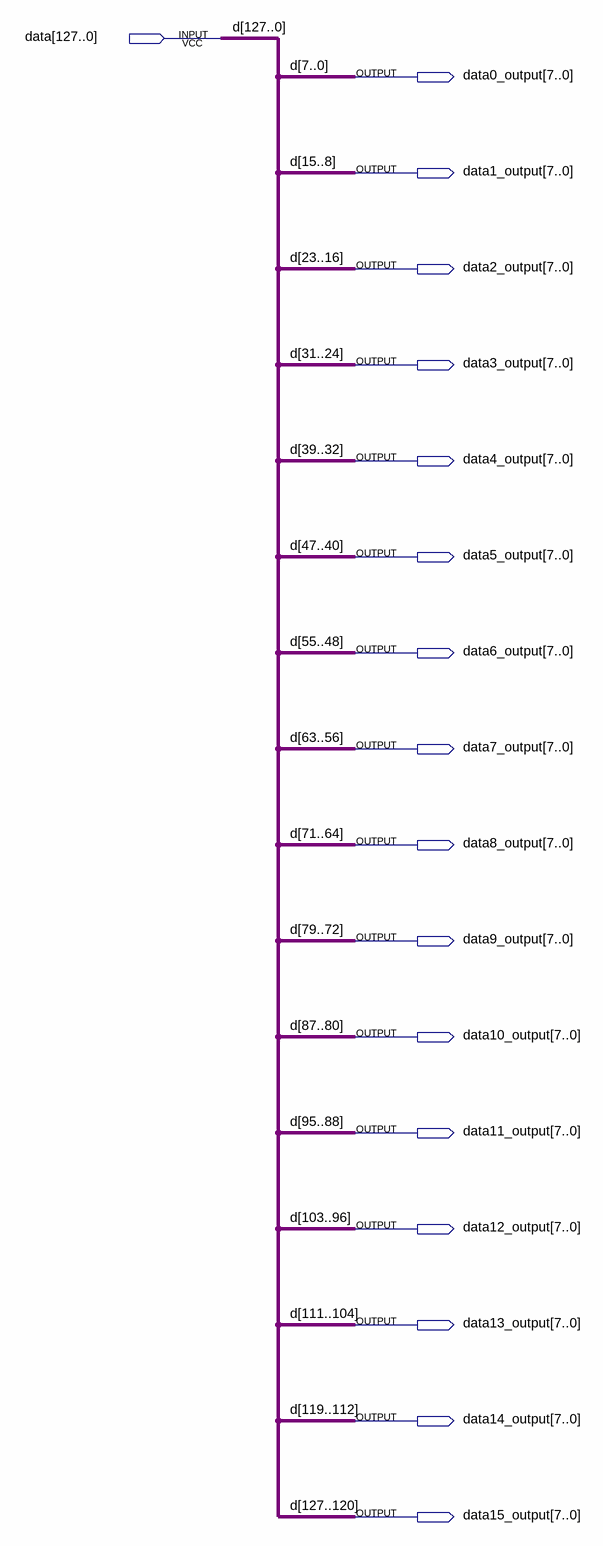
[diagram p0: schematic sheet]
// Quartus schematic 128to16.bdf as structural Verilog: 0 symbols, 17 pins
module \128to16  (
  input  [127:0] data,
  output [7:0] data0_output,
  output [7:0] data1_output,
  output [7:0] data2_output,
  output [7:0] data3_output,
  output [7:0] data4_output,
  output [7:0] data5_output,
  output [7:0] data6_output,
  output [7:0] data7_output,
  output [7:0] data8_output,
  output [7:0] data9_output,
  output [7:0] data10_output,
  output [7:0] data11_output,
  output [7:0] data12_output,
  output [7:0] data13_output,
  output [7:0] data14_output,
  output [7:0] data15_output
);


  assign data0_output = data[7:0];
  assign data1_output = data[15:8];
  assign data2_output = data[23:16];
  assign data3_output = data[31:24];
  assign data4_output = data[39:32];
  assign data5_output = data[47:40];
  assign data6_output = data[55:48];
  assign data7_output = data[63:56];
  assign data8_output = data[71:64];
  assign data9_output = data[79:72];
  assign data10_output = data[87:80];
  assign data11_output = data[95:88];
  assign data12_output = data[103:96];
  assign data13_output = data[111:104];
  assign data14_output = data[119:112];
  assign data15_output = data[127:120];

  // Other names for the same wires on the sheet: d[127:0] = data
endmodule
